# EasyEDA schematic LcsNodes-Dual-Block-Controller-B.02.10.json

## Sheets
1 Main Controller
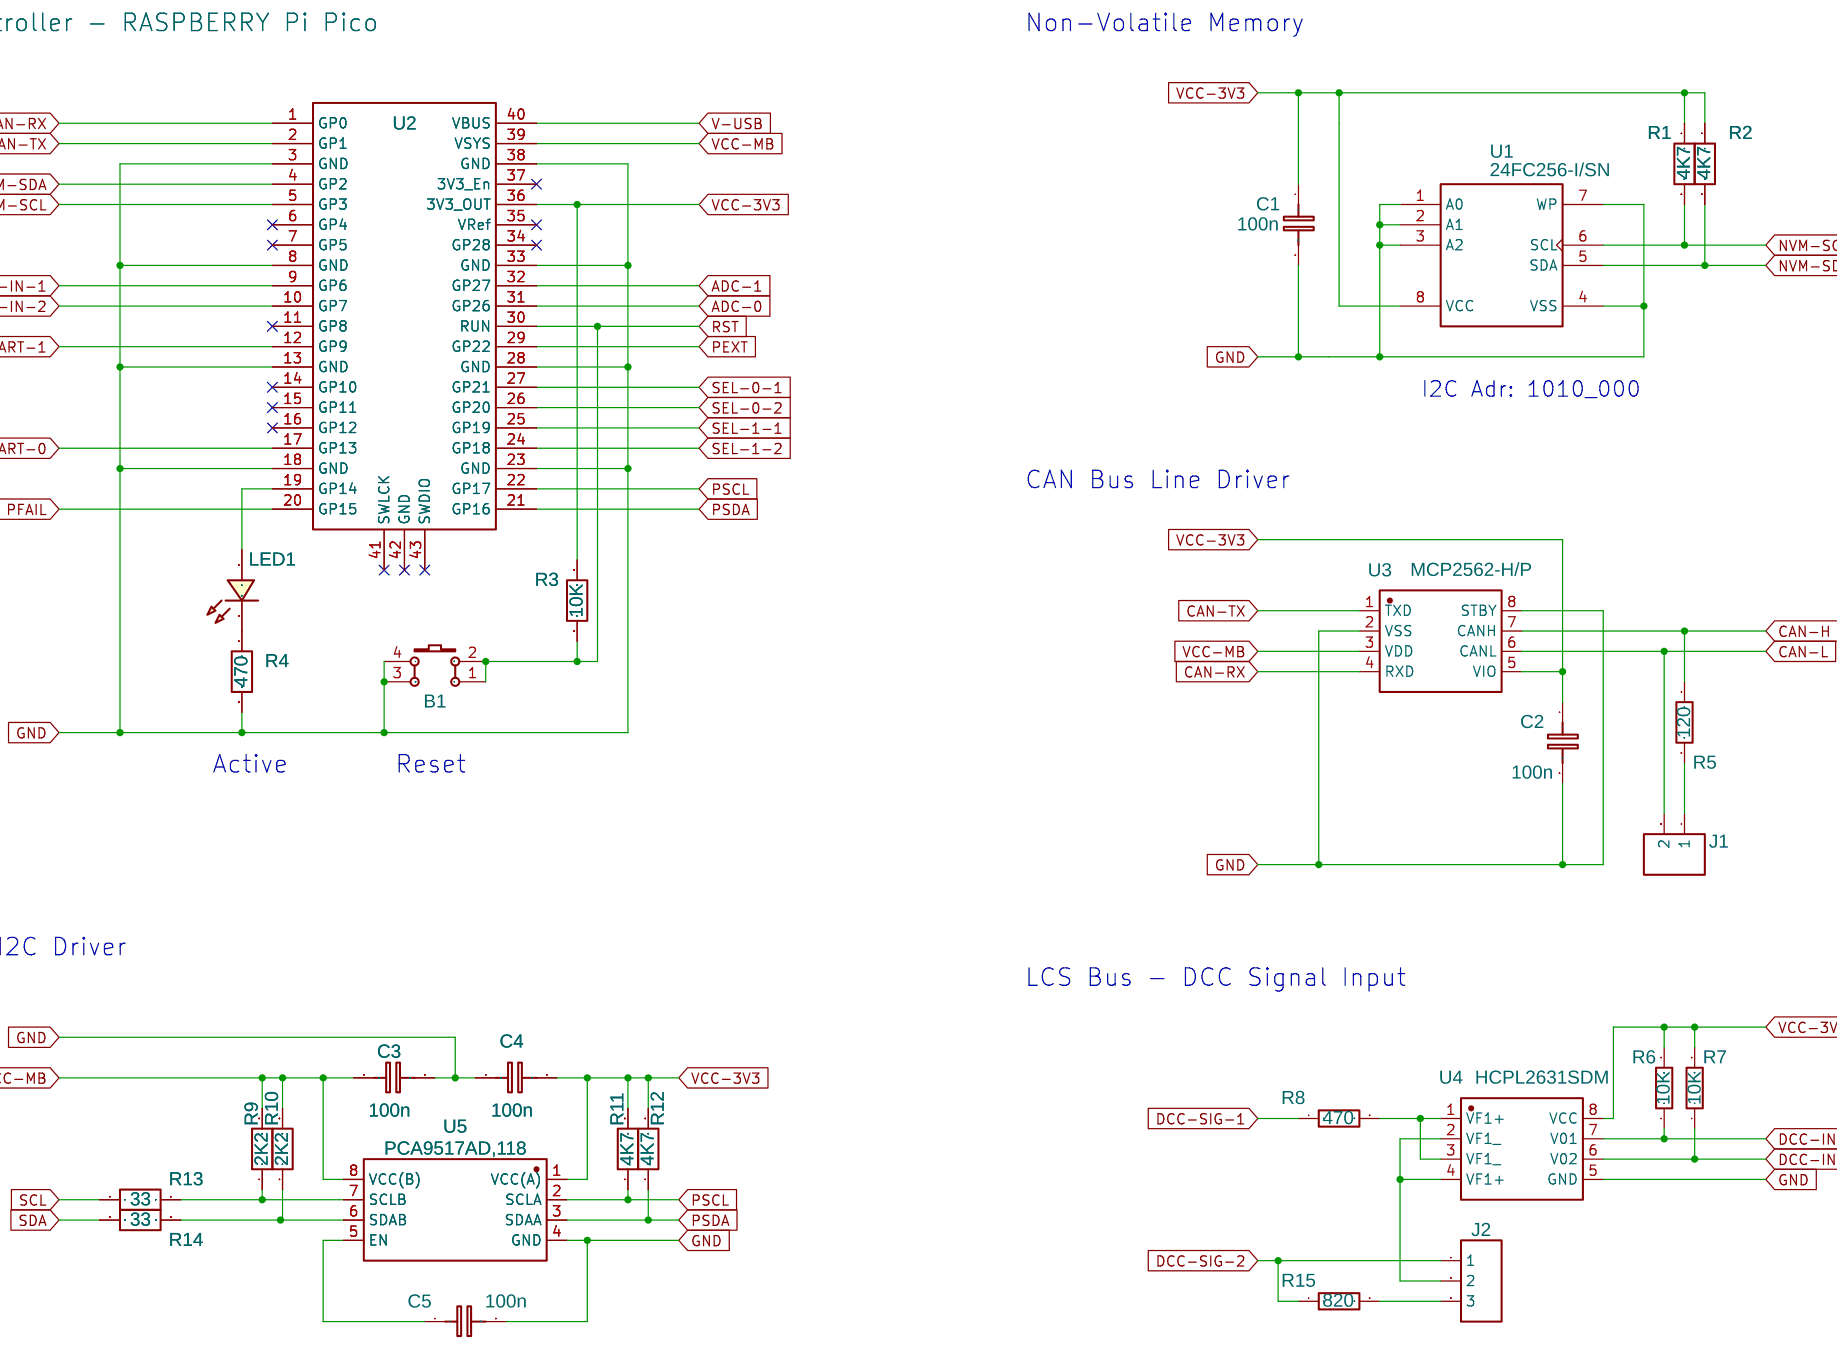
[diagram p0: Main Controller]
2 High Level Schematic
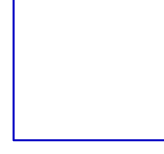
[diagram p1: High Level Schematic]
3 Dual Power Unit
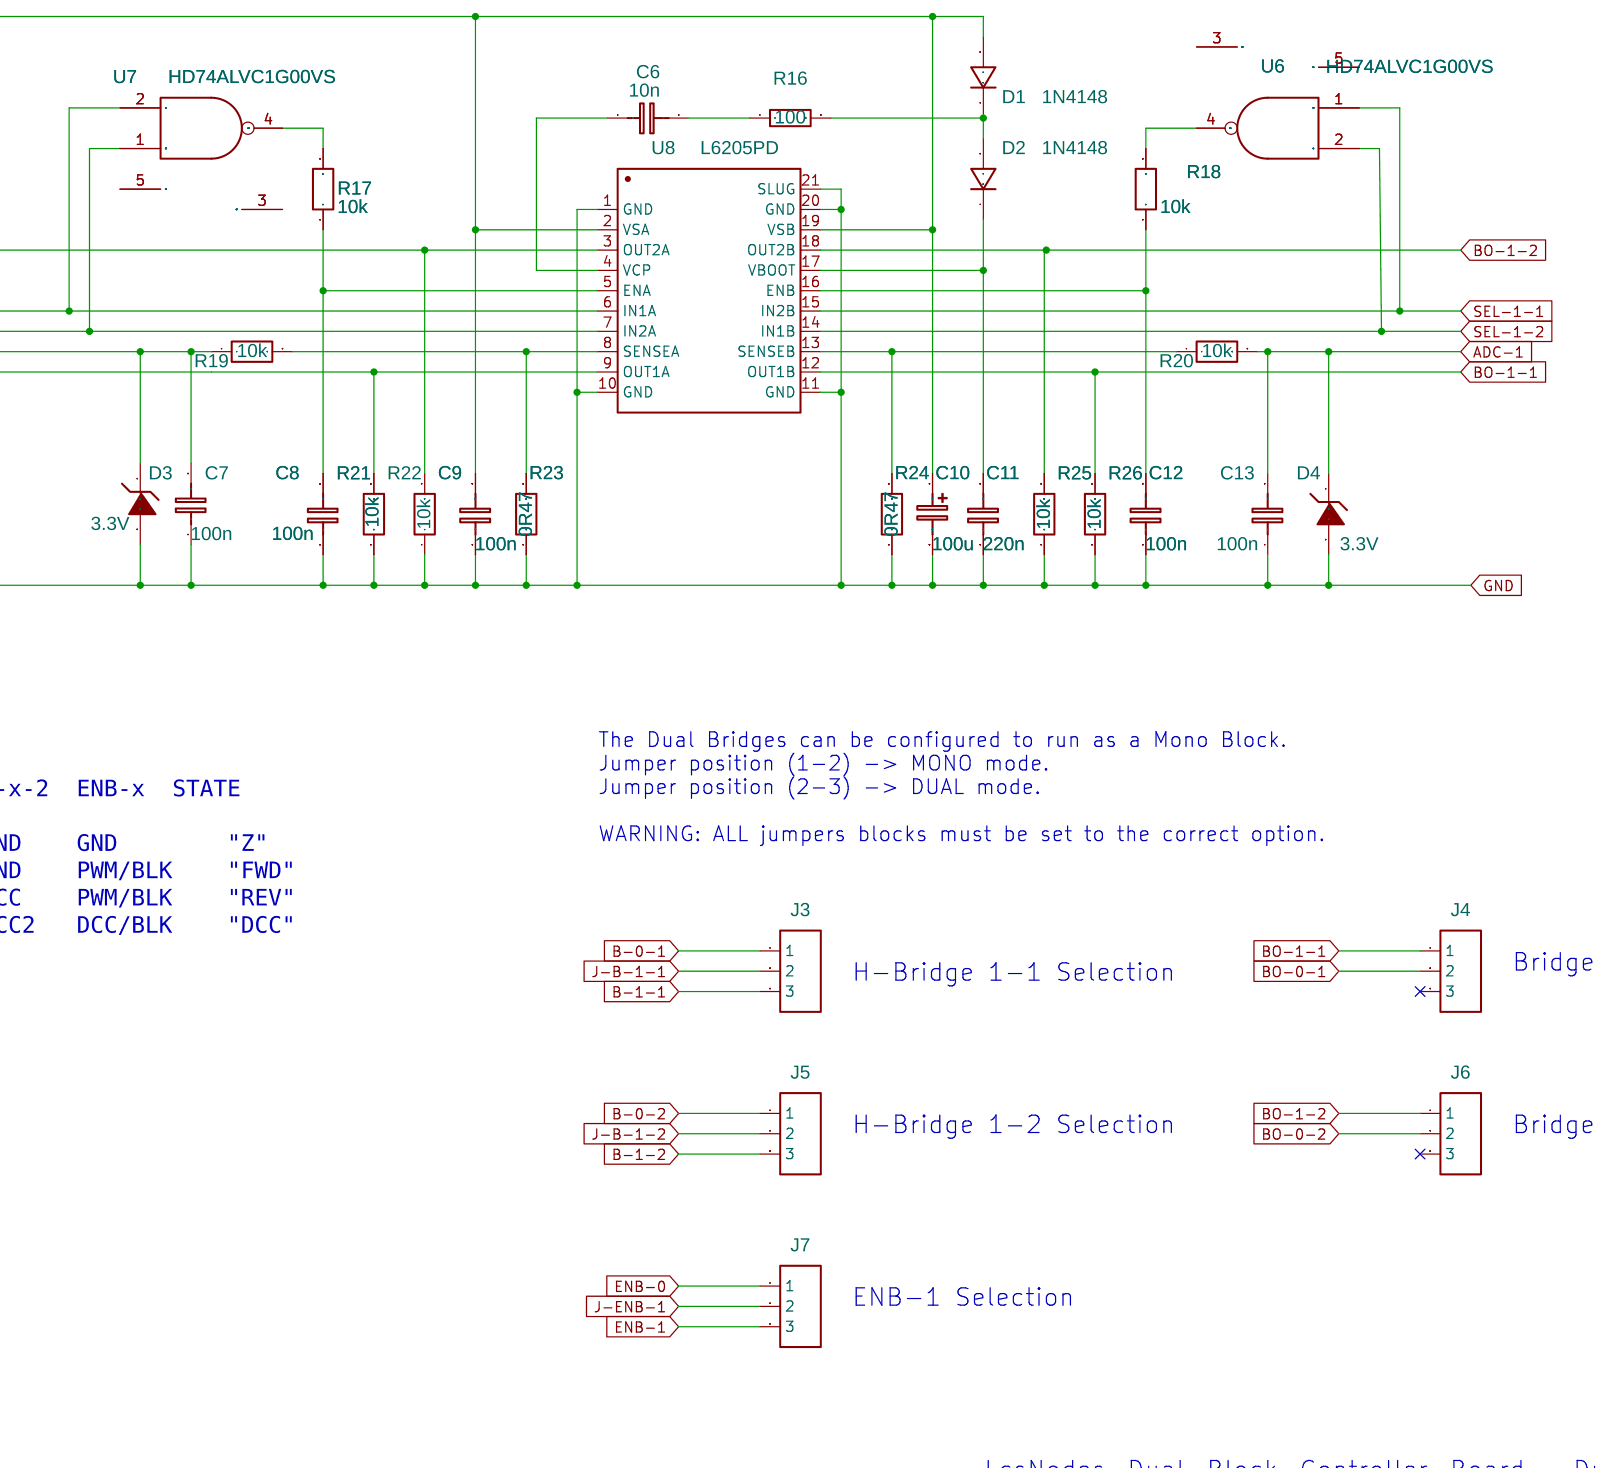
[diagram p2: Dual Power Unit]
4 Power Supply, Connectors
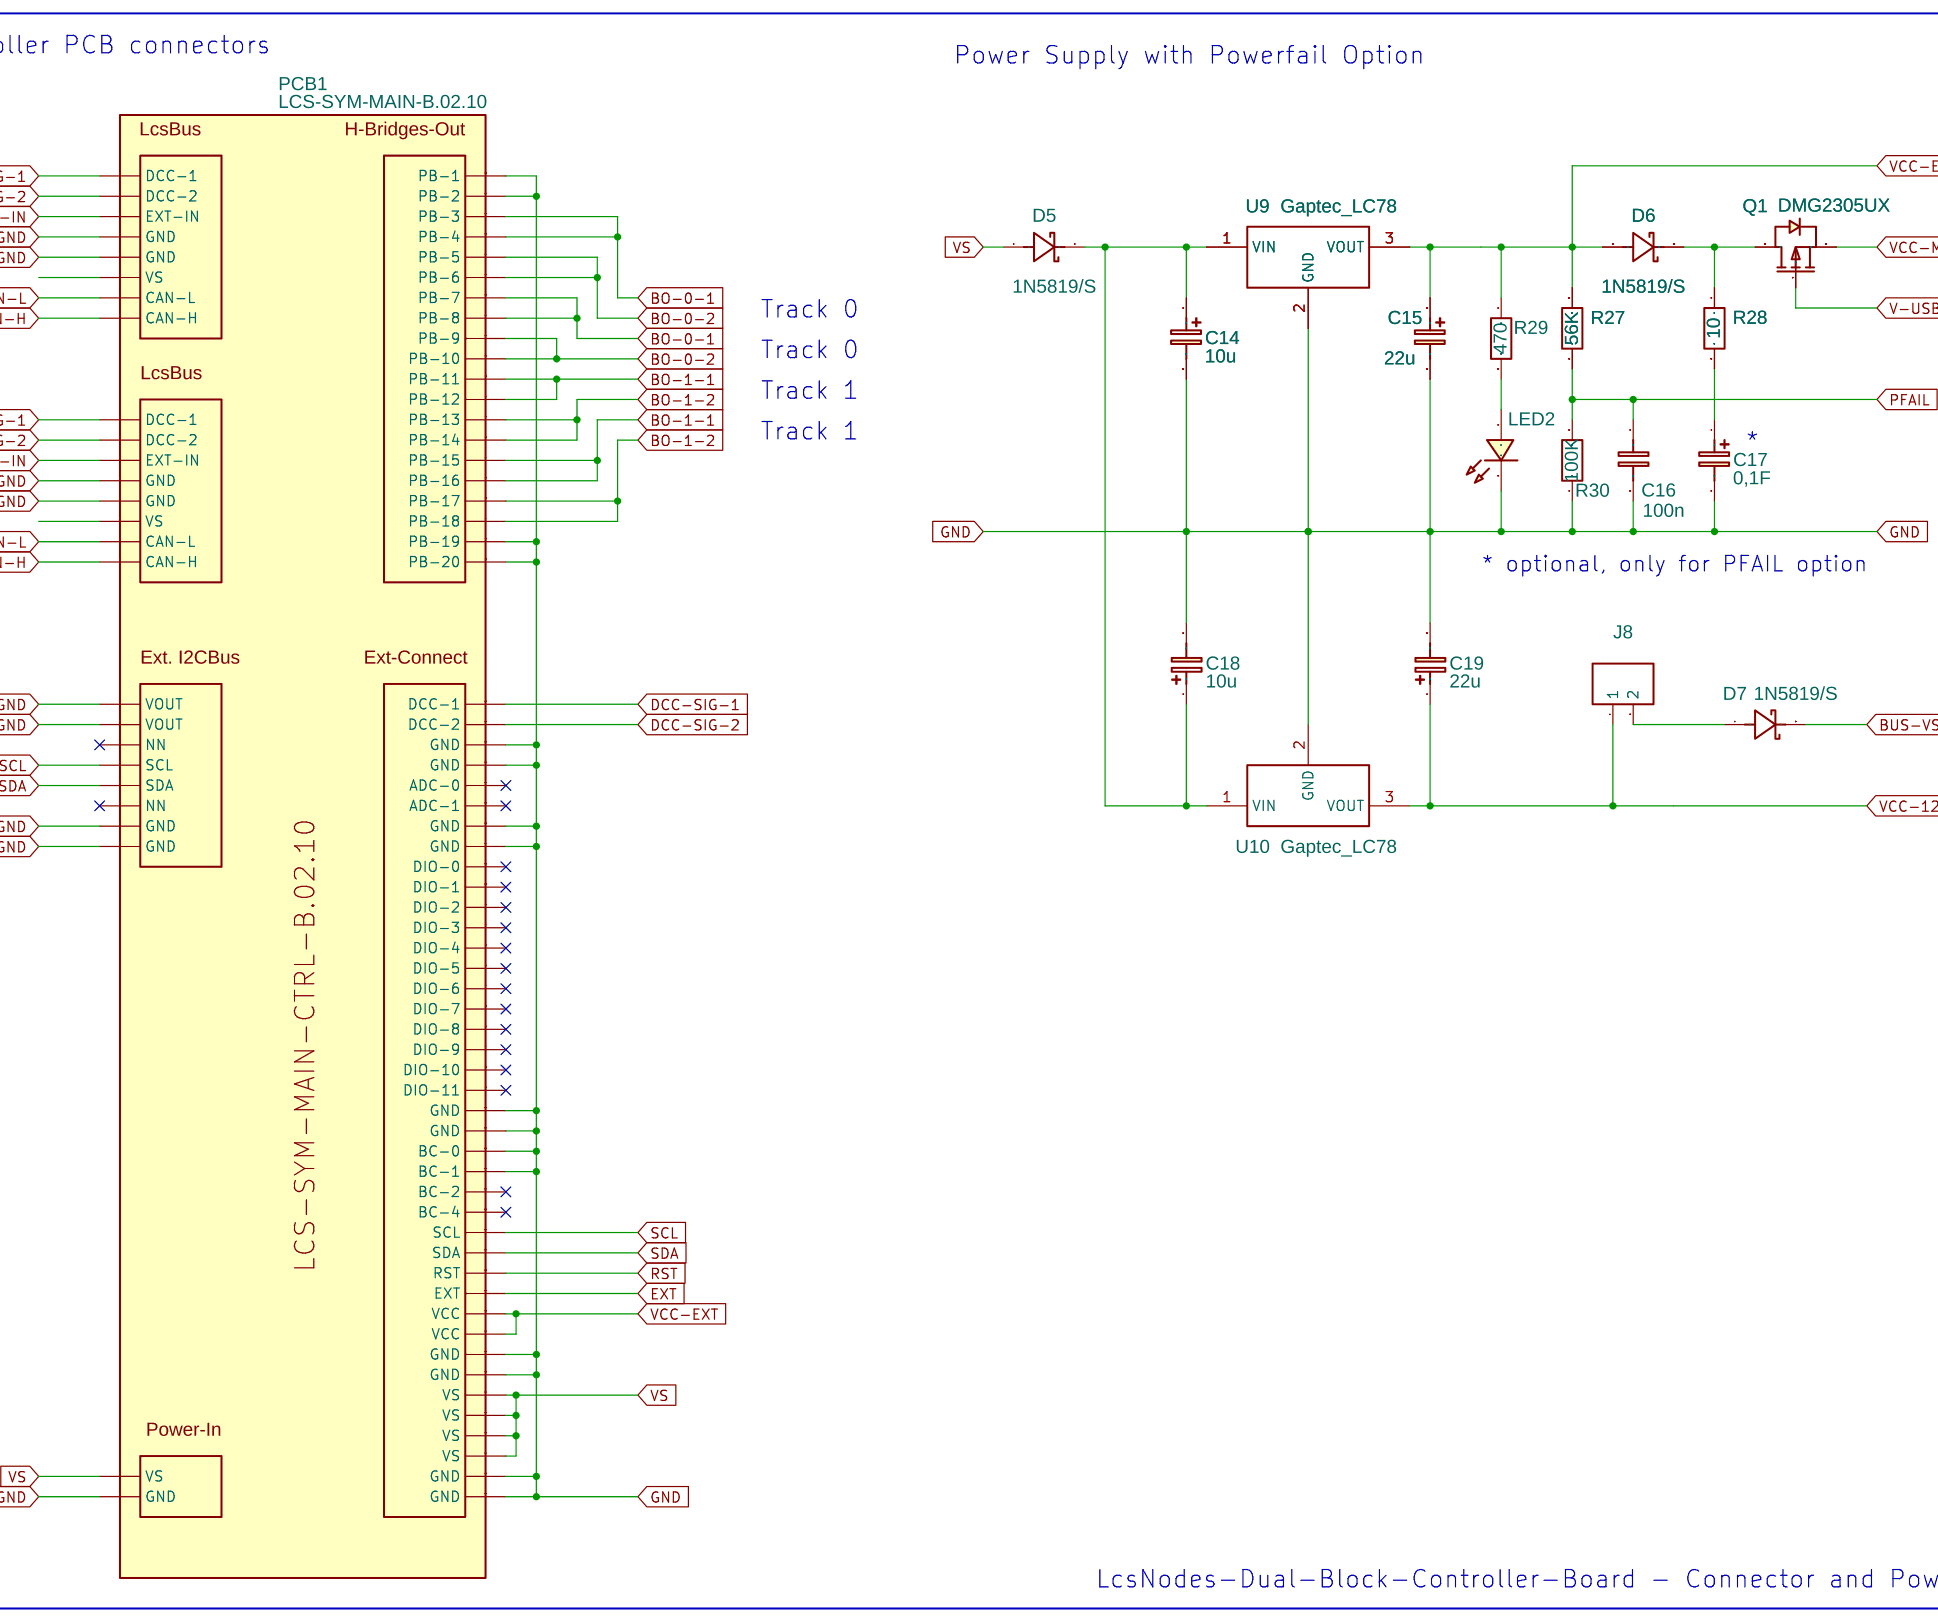
[diagram p3: Power Supply, Connectors]

## Parts
sheet Dual Power Unit
C6  10n  [C1206]
C7  100n  [C1206]
C8  100n  [C1206]
C9  100n  [C1206]
C10  100u  [CAP-D6.3×H7.7]
C11  220n  [C1206]
C12  100n  [C1206]
C13  100n  [C1206]
D1  1N4148  [SOD-80C_L3.3-W1.5-RD]
D2  1N4148  [SOD-80C_L3.3-W1.5-RD]
D3  3.3V  [SOD-80C_L3.3-W1.5-RD]
D4  3.3V  [SOD-80C_L3.3-W1.5-RD]
J3  HDR-M-2.54_1x3  [HDR-M-2.54_1X3]
J4  HDR-M-2.54_1x3  [HDR-M-2.54_1X3]
J5  HDR-M-2.54_1x3  [HDR-M-2.54_1X3]
J6  HDR-M-2.54_1x3  [HDR-M-2.54_1X3]
J7  HDR-M-2.54_1x3  [HDR-M-2.54_1X3]
R16  100  [R1206]
R17  10k  [R1206]
R18  10k  [R1206]
R19  10k  [R1206]
R20  10k  [R1206]
R21  10k  [R1206]
R22  10k  [R1206]
R23  0R47  [R_AXIAL-0.7]
R24  0R47  [R_AXIAL-0.7]
R25  10k  [R1206]
R26  10k  [R1206]
U6  HD74ALVC1G00VS  [PUSN0005KA-A]
U7  HD74ALVC1G00VS  [PUSN0005KA-A]
U8  L6205PD  [POWERSO20_L15.9-W11.0-P1.27-LS14.2-BL-EP]
sheet Main Controller
B1  Opt  [SW-SMD_4P-L6.0-W6.0-P4.50-LS9.0_C23873]
C1  100n  [C1206]
C2  100n  [C1206]
C3  100n  [C1206]
C4  100n  [C1206]
C5  100n  [C1206]
J1  HDR-M-2.54_1x2  [HDR-M-2.54_1X2]
J2  HDR-M-2.54_1x3  [HDR-M-2.54_1X3]
LED1  LED-0805_G  [LED-1206]
R1  4K7  [R1206]
R2  4K7  [R1206]
R3  10K  [R1206]
R4  470  [R1206]
R5  120  [R1206]
R6  10K  [R1206]
R7  10K  [R1206]
R8  470  [R1206]
R9  2K2  [R1206]
R10  2K2  [R1206]
R11  4K7  [R1206]
R12  4K7  [R1206]
R13  33  [R1206]
R14  33  [R1206]
R15  820  [R1206]
U1  24FC256-I/SN  [SOIC-8_L4.9-W3.9-P1.27-LS6.0-BL]
U2  Main Controller - RASPBERRY Pi Pico  [RASPBERRY PI PICO]
U3  MCP2562-H/P  [SOIC-8_L4.9-W3.9-P1.27-LS6.1-BL]
U4  HCPL2631SDM  [SMT-8_L9.7-W6.6-P2.54-LS10.3-TR]
U5  PCA9517AD,118  [SO-8_L4.9-W3.9-P1.27-LS6.0-BL]
sheet Power Supply, Connectors
C14  10u  [CAP-D5.0×H5.5]
C15  22u  [CAP-D5.0×H5.5]
C16  100n  [C1206]
C17  0,1F  [CAP-D12.5XF5.0]
C18  10u  [CAP-D5.0×H5.5]
C19  22u  [CAP-D5.0×H5.5]
D5  1N5819/S  [SMA_L4.3-W2.6-LS5.2-R-RD]
D6  1N5819/S  [SMA_L4.3-W2.6-LS5.2-R-RD]
D7  1N5819/S  [SMA_L4.3-W2.6-LS5.2-R-RD]
J8  HDR-M-2.54_1x2  [HDR-M-2.54_1X2]
LED2  LED-0805_G  [LED-1206]
PCB1  LCS-SYM-MAIN-B.02.10  [LCS-FP-MAIN-CTRL-10X12]
Q1  DMG2305UX  [SOT-23-3_L2.9-W1.3-P0.95-LS2.4-BR-1]
R27  56K  [R1206]
R28  10  [R1206]
R29  470  [R1206]
R30  100K  [R1206]
U9  Gaptec_LC78  [GAPTEC_LC78]
U10  Gaptec_LC78  [GAPTEC_LC78]

## Library data of the parts
C6-C9 C11-C13 = C_0603_EU: Contributor: LCEDA_Lib
C10 C14 C15 C18 C19 = CE_SMD_D5.0×H5.5_EU: Contributor: LCEDA_Lib
D1 D2 = 1N4148: Supplier: LCSC; Manufacturer: SEMTECH; Supplier Part: C14516; Contributor: LCEDA_Lib
D3 D4 = Diode Zener: Supplier: LCSC; Manufacturer: SEMTECH; Supplier Part: C14516; JLCPCB Part Class: Extended Part; Contributor: Arrost
J2-J7 = HDR-M-2.54_1x3: Supplier Part: C180248; Supplier: LCSC; Contributor: LCEDA_Lib
R5 R16 = RESISTOR-AXIAL-0.1
R17-R22 R25-R28 R30 = R_AXIAL-0.3_EU: Contributor: LCEDA_Lib
R23 R24 = R_AXIAL-0.5_EU: Contributor: LCEDA_Lib
U6 U7 = HD74ALVC1G00VS: 2-Input NAND Gate
U8 = L6205PD: Supplier: LCSC; Manufacturer: ST(意法半导体); Manufacturer Part: L6205PD013TR; Supplier Part: C36543; JLCPCB Part Class: Extended Part
B1 = K4-6×6_TH: Supplier: LCSC; Supplier Part: C136684; Manufacturer: 韩国韩荣; Manufacturer Part: K2-1102DP-E4SW-04; Contributor: LCEDA_Lib; Package Display: No
C1 C2 = C_0603_EU: Contributor: LCEDA_Lib; Package Display: No
C3-C5 C16 = C_RAD-0.2_EU: Contributor: LCEDA_Lib
J1 J8 = HDR-M-2.54_1x2: Supplier Part: C124375; Supplier: LCSC; Contributor: LCEDA_Lib
LED1 LED2 = LED-0805_G: Manufacturer: 国星光电; Manufacturer Part: NCD0805G1; Supplier Part: C84260; Contributor: LCEDA_Lib
R1-R4 R9-R12 R29 = R_0805_EU: Contributor: LCEDA_Lib
R6-R8 R15 = SR1206JR-7W4K7L: Contributor: LCSC; Supplier: LCSC; Supplier Part: C326768; Manufacturer: YAGEO(国巨); JLCPCB Part Class: Extended Part; link: https://lcsc.com/eda_search?q=C326768&%26type=1&ref=editor
R13 R14 = R_1206_EU: Contributor: LCEDA_Lib
U1 = 24FC256-I/SN: Supplier: LCSC; Manufacturer: MICROCHIP(美国微芯); Contributor: LCSC; Supplier Part: C145385; JLCPCB Part Class: Extended Part
U2 = RASPBERRY Pi Pico Through Holes: Contributor: untung91
U3 = MCP2562-H/P: Supplier: LCSC; Supplier Part: C640348; Manufacturer: MICROCHIP(美国微芯); link: https://atta.szlcsc.comnull; Contributor: lcsc
U4 = HCPL2631SDM: Contributor: LCSC; Supplier: LCSC; Supplier Part: C899529; Manufacturer: onsemi(安森美); JLCPCB Part Class: Extended Part
U5 = PCA9517AD,118: Contributor: LCSC; Supplier: LCSC; Supplier Part: C2802638; Manufacturer: NXP(恩智浦); JLCPCB Part Class: Extended Part
C17 = C_Tan_SMD_A_EU: Contributor: LCEDA_Lib
D5-D7 = 1N5819/S: Supplier: LCSC; Supplier Part: C9900003833; JLCPCB Part Class: Extended Part; Contributor: LCSC
PCB1 = LCS-SYM-MAIN-B.02.10: Contributor: helmut-f
Q1 = DMG2305UX: Supplier: LCSC; Supplier Part: C2940629; Manufacturer: TECH PUBLIC(台舟); link: https://atta.szlcsc.com//upload/public/pdf/source/20220124/672A40BC72F4DE27873D6595D2E3AF1A.pdf; Contributor: LCSC; JLCPCB Part Class: Extended Part
U9 U10 = Gaptec_LC78: Contributor: SpicyMemeBoi; Package Display: No

## Nets
GND: B1.3 B1.4 C1.2 C2.2 C3.2 C4.1 C5.2 C7.1 C8.1 C9.1 C10.2 C11.1 C12.1 C13.1 C14.2 C15.2 C16.2 C17.2 C18.2 C19.2 D3.2(A) D4.2(A) LED2.2 PCB1.4(GND) PCB1.5(GND) PCB1.14(GND) PCB1.15(GND) PCB1.21(VOUT) PCB1.22(VOUT) PCB1.27(GND) PCB1.28(GND) PCB1.30(PB-1) PCB1.31(PB-2) PCB1.48(PB-19) PCB1.49(PB-20) PCB1.62(GND) PCB1.63(GND) PCB1.66(GND) PCB1.67(GND) PCB1.80(GND) PCB1.81(GND) PCB1.82(BC-0) PCB1.83(BC-1) PCB1.92(GND) PCB1.93(GND) PCB1.98(GND) PCB1.99(GND) PCB1.101(GND) R4.2 R21.1 R22.1 R23.1 R24.1 R25.1 R26.1 R30.1 U1.1(A0) U1.2(A1) U1.3(A2) U1.4(VSS) U1.7(WP) U2.3(GND) U2.8(GND) U2.13(GND) U2.18(GND) U2.23(GND) U2.28(GND) U2.33(GND) U2.38(GND) U3.2(VSS) U3.8(STBY) U4.5(GND) U5.4(GND) U8.1(GND) U8.10(GND) U8.11(GND) U8.20(GND) U8.21(SLUG) U9.2(GND) U10.2(GND)
VCC-3V3: C1.1 C2.1 C4.2 R1.1 R2.1 R3.2 R6.2 R7.2 R11.2 R12.2 U1.8(VCC) U2.36(3V3_OUT) U3.5(VIO) U4.8(VCC) U5.1(VCC(A))
VCC-12V: C19.1 J8.1 U10.3(VOUT)
VCC-EXT: C15.1 D6.1(A) PCB1.90(VCC) PCB1.91(VCC) R27.2 R29.1 U9.3(VOUT)
VCC-MB: C3.1 Q1.2(S) R9.2 R10.2 U2.39(VSYS) U3.3(VDD) U5.8(VCC(B))
ADC-0: C7.2 D3.1(C) R19.1 U2.31(GP26)
ADC-1: C13.2 D4.1(C) R20.2 U2.32(GP27)
B-0-1: J3.1
B-0-2: J5.1
B-1-1: J3.3
B-1-2: J5.3
BO-0-1: J4.2 PCB1.32(PB-3) PCB1.33(PB-4) PCB1.36(PB-7) PCB1.37(PB-8) R21.2 U8.9(OUT1A)
BO-0-2: J6.2 PCB1.34(PB-5) PCB1.35(PB-6) PCB1.38(PB-9) PCB1.39(PB-10) R22.2 U8.3(OUT2A)
BO-1-1: J4.1 PCB1.40(PB-11) PCB1.41(PB-12) PCB1.44(PB-15) PCB1.45(PB-16) R26.2 U8.12(OUT1B)
BO-1-2: J6.1 PCB1.42(PB-13) PCB1.43(PB-14) PCB1.46(PB-17) PCB1.47(PB-18) R25.2 U8.18(OUT2B)
BUS-VS: D7.2(K)
CAN-H: PCB1.8(CAN-H) PCB1.18(CAN-H) R5.1 U3.7(CANH)
CAN-L: J1.2 PCB1.7(CAN-L) PCB1.17(CAN-L) U3.6(CANL)
CAN-RX: U2.1(GP0) U3.4(RXD)
CAN-TX: U2.2(GP1) U3.1(TXD)
DCC-IN-1: R6.1 U2.9(GP6) U4.7(V01)
DCC-IN-2: R7.1 U2.10(GP7) U4.6(V02)
DCC-SIG-1: PCB1.1(DCC-1) PCB1.11(DCC-1) PCB1.60(DCC-1) R8.1
DCC-SIG-2: J2.1 PCB1.2(DCC-2) PCB1.12(DCC-2) PCB1.61(DCC-2) R15.1
ENB-0: J7.1
ENB-1: J7.3
EXT: PCB1.89(EXT)
EXT-IN: PCB1.3(EXT-IN) PCB1.13(EXT-IN)
J-B-1-1: J3.2
J-B-1-2: J5.2
J-ENB-1: J7.2
NVM-SCL: R1.2 U1.6(SCL) U2.5(GP3)
NVM-SDA: R2.2 U1.5(SDA) U2.4(GP2)
PEXT: U2.29(GP22)
PFAIL: C16.1 R27.1 R30.2 U2.20(GP15)
PSCL: R11.1 U2.22(GP17) U5.2(SCLA)
PSDA: R12.1 U2.21(GP16) U5.3(SDAA)
RST: B1.1 B1.2 PCB1.88(RST) R3.1 U2.30(RUN)
SCL: PCB1.24(SCL) PCB1.86(SCL) R13.1
SDA: PCB1.25(SDA) PCB1.87(SDA) R14.1
SEL-0-1: U2.27(GP21) U7.2(IN A) U8.6(IN1A)
SEL-0-2: U2.26(GP20) U7.1(IN B) U8.7(IN2A)
SEL-1-1: U2.25(GP19) U6.1(IN B) U8.15(IN2B)
SEL-1-2: U2.24(GP18) U6.2(IN A) U8.14(IN1B)
UART-0: U2.17(GP13)
UART-1: U2.12(GP9)
V-USB: Q1.1(G) U2.40(VBUS)
VS: C9.2 C10.1 D1.2(1) D5.1(A) PCB1.94(VS) PCB1.95(VS) PCB1.96(VS) PCB1.97(VS) PCB1.100(VS) U8.2(VSA) U8.19(VSB)
Net-(C5-1): C5.1 U5.5(EN)
Net-(C6-1): C6.1 U8.4(VCP)
Net-(C6-2): C6.2 R16.1
Net-(C8-2): C8.2 R17.1 U8.5(ENA)
Net-(C11-2): C11.2 D2.1(2) U8.17(VBOOT)
Net-(C12-2): C12.2 R18.1 U8.16(ENB)
Net-(C14-1): C14.1 C18.1 D5.2(K) U9.1(VIN) U10.1(VIN)
Net-(C17-1): C17.1 R28.2
Net-(D1-1): D1.1(2) D2.2(1) R16.2
Net-(D6-2): D6.2(K) Q1.3(D) R28.1
Net-(D7-1): D7.1(A) J8.2
Net-(J1-1): J1.1 R5.2
Net-(J2-2): J2.2 U4.2(VF1_) U4.4(VF1+)
Net-(J2-3): J2.3 R15.2
Net-(LED1-1): LED1.1 U2.19(GP14)
Net-(LED1-2): LED1.2 R4.1
Net-(LED2-1): LED2.1 R29.2
Net-(R8-2): R8.2 U4.1(VF1+) U4.3(VF1_)
Net-(R9-1): R9.1 R13.2 U5.7(SCLB)
Net-(R10-1): R10.1 R14.2 U5.6(SDAB)
Net-(R17-2): R17.2 U7.4(OUT Y)
Net-(R18-2): R18.2 U6.4(OUT Y)
Net-(R19-2): R19.2 R23.2 U8.8(SENSEA)
Net-(R20-1): R20.1 R24.2 U8.13(SENSEB)

Not connected (* = marked no-connect by the designer): J4 3*; J6 3*; PCB1 6(VS) 16(VS) 23(NN)* 26(NN)* 64(ADC-0)* 65(ADC-1)* 68(DIO-0)* 69(DIO-1)* 70(DIO-2)* 71(DIO-3)* 72(DIO-4)* 73(DIO-5)* 74(DIO-6)* 75(DIO-7)* 76(DIO-8)* 77(DIO-9)* 78(DIO-10)* 79(DIO-11)* 84(BC-2)* 85(BC-4)*; U2 6(GP4)* 7(GP5)* 11(GP8)* 14(GP10)* 15(GP11)* 16(GP12)* 34(GP28)* 35(VRef)* 37(3V3_En)* 41(SWLCK)* 42(GND)* 43(SWDIO)*; U6 3(GND) 5(VCC); U7 3(GND) 5(VCC)

## Notes on the sheets
sheet 1
- Non-Volatile Memory
- I2C Adr: 1010_000
- CAN Bus Line Driver
- Active
- Reset
- External I2C Driver
- LCS Bus - DCC Signal Input
- LcsNodes-Dual-Block-Controller-Board - Main Controller - Page 2 of 4
sheet 2
- DCC Signal Detect
  Control Logic
- Cutout
- Disable
- H-Bridge
- RC
  detector
- CAN
  Driver
- B-Ctrl-0
- B-Power
  Meas-0
- LCS Bus Connector
- Analog
  Input/Select
- Analog
  OpAmp
- RC-In-0
- Track Connector
- Select
- NVM
  Memory
- I2C
- coupling
- Bridge-Control
- B-Ctrl-1
- B-Power
  Meas-1
- H-Bridge
- RC
  detector
- RC-In-1
- Raspberry PI
  PICO
- Analog
  OpAmp
- Serial In
- RC
- Control Logic
- I2C
  extern
- I2C
- Power
- Power Supply
- Extension Connector
- Power
- LcsNodes-Dual-Block-Controller-Board - Block Diagram - Page 1 of 4
sheet 3
- Dual H-Bridge
- Control Logic Signals:
  Sel-2 Sel-1 -> B-x-1 B-x-2  ENB-x  STATE
  0     0     -> GND   GND    GND        "Z"
  0     1     -> VCC   GND    PWM/BLK    "FWD"
  1     0     -> GND   VCC    PWM/BLK    "REV"
  1     1     -> DCC1  DCC2   DCC/BLK    "DCC"
- The Dual Bridges can be configured to run as a Mono Block.
  Jumper position (1-2) -> MONO mode.
  Jumper position (2-3) -> DUAL mode.
  WARNING: ALL jumpers blocks must be set to the correct option.
- H-Bridge 1-1 Selection
- Bridge Paralell Mode
- ENB == LOW -> Z
- H-Bridge 1-2 Selection
- Bridge Paralell Mode
- ENB-1 Selection
- LcsNodes-Dual-Block-Controller-Board - Dual Power Unit - Page 3 of 4
sheet 4
- Block Controller PCB connectors
- Power Supply with Powerfail Option
- Track 0
- Track 0
- Track 1
- Track 1
- *
- * optional, only for PFAIL option
- LcsNodes-Dual-Block-Controller-Board - Connector and Power - Page 4 of 4
